# EAGLE schematic ESWschematic (EAGLE 9.2.2)
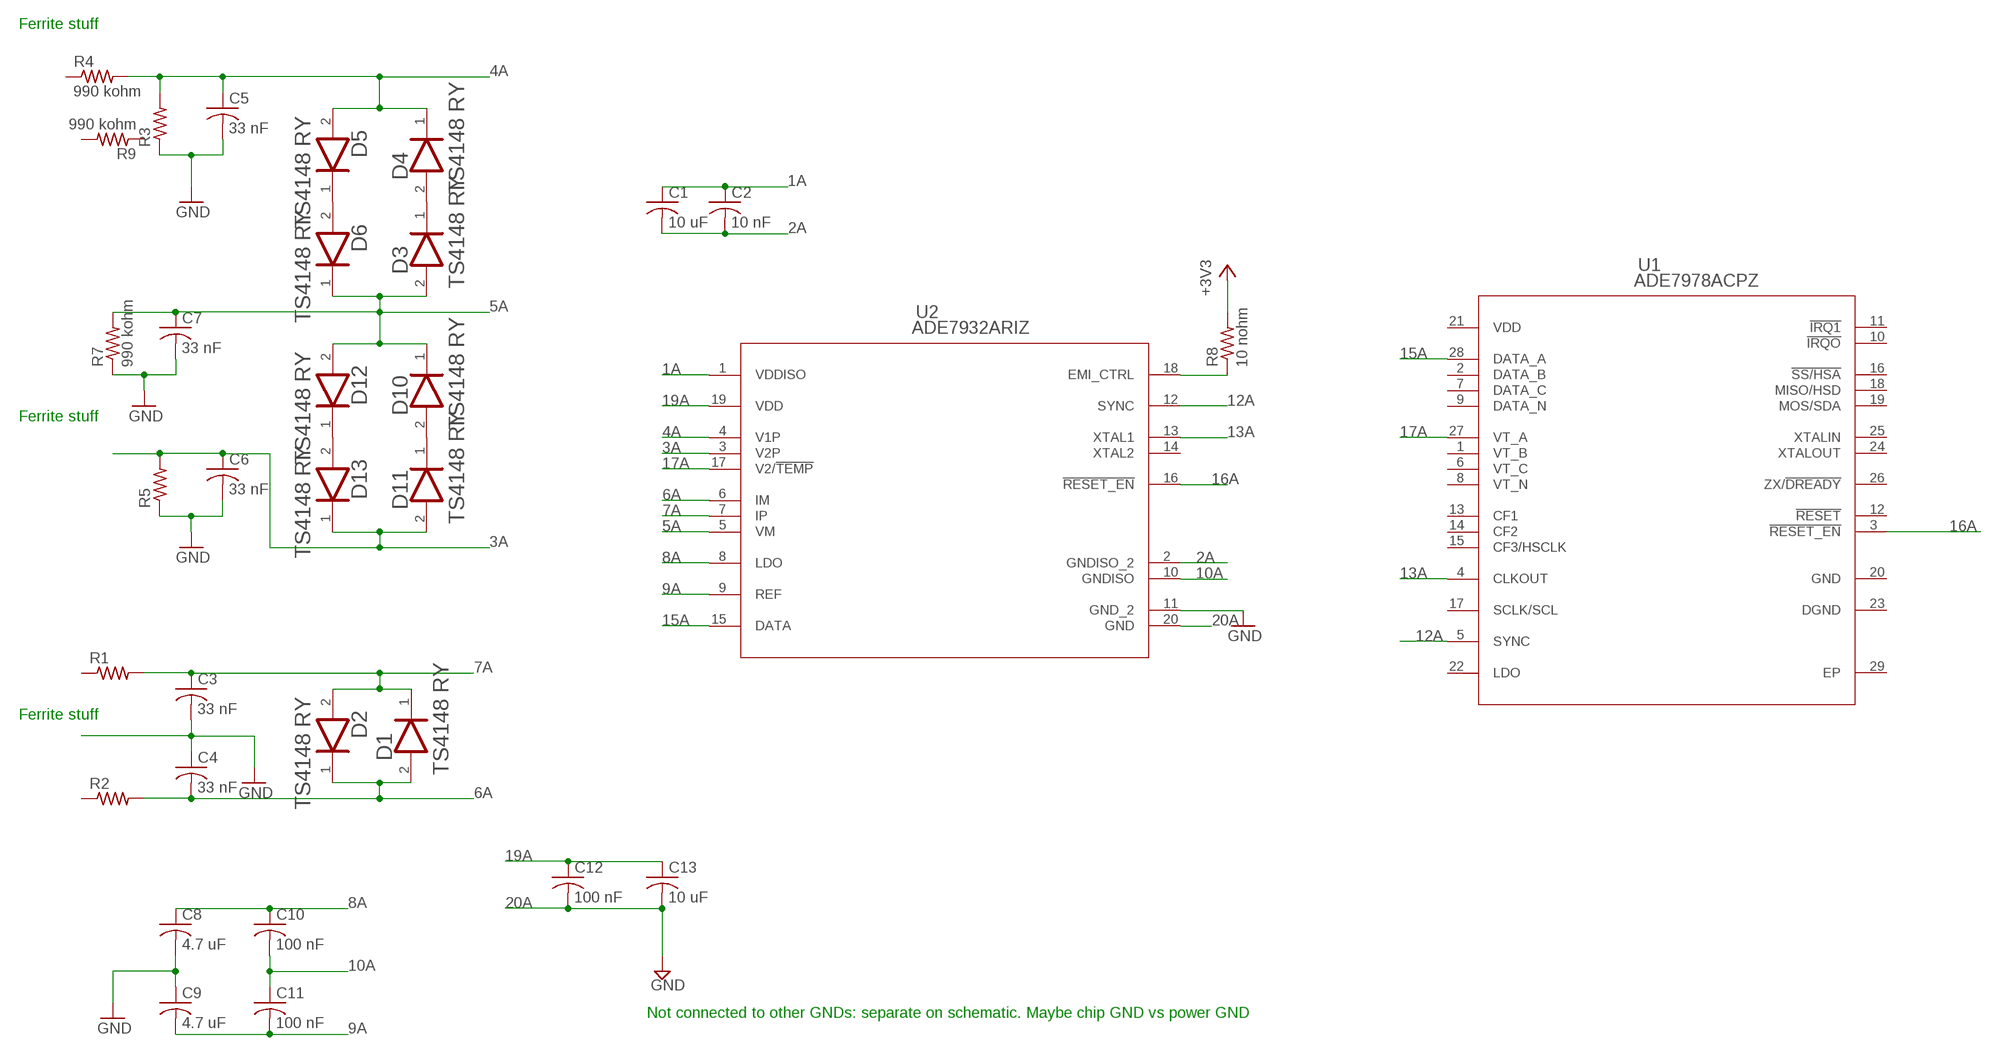
[diagram p0: schematic, sheet 1]

## Parts
C1  10 uF  C-USC0805  [C0805]
C2  10 nF  C-USC0805  [C0805]
C3  33 nF  C-USC0805  [C0805]
C4  33 nF  C-USC0805  [C0805]
C5  33 nF  C-USC0805  [C0805]
C6  33 nF  C-USC0805  [C0805]
C7  33 nF  C-USC0805  [C0805]
C8  4.7 uF  C-USC0805  [C0805]
C9  4.7 uF  C-USC0805  [C0805]
C10  100 nF  C-USC0805  [C0805]
C11  100 nF  C-USC0805  [C0805]
C12  100 nF  C-USC0805  [C0805]
C13  10 uF  C-USC0805  [C0805]
D1  TAIWAN_SEMICONDUCTOR_TS4148_RYTAIWAN_SEMICONDUCTOR_TS4148_RY_0_0  [TAIWAN_SEMICONDUCTOR_TS4148_RY_0]
D2  TAIWAN_SEMICONDUCTOR_TS4148_RYTAIWAN_SEMICONDUCTOR_TS4148_RY_0_0  [TAIWAN_SEMICONDUCTOR_TS4148_RY_0]
D3  TAIWAN_SEMICONDUCTOR_TS4148_RYTAIWAN_SEMICONDUCTOR_TS4148_RY_0_0  [TAIWAN_SEMICONDUCTOR_TS4148_RY_0]
D4  TAIWAN_SEMICONDUCTOR_TS4148_RYTAIWAN_SEMICONDUCTOR_TS4148_RY_0_0  [TAIWAN_SEMICONDUCTOR_TS4148_RY_0]
D5  TAIWAN_SEMICONDUCTOR_TS4148_RYTAIWAN_SEMICONDUCTOR_TS4148_RY_0_0  [TAIWAN_SEMICONDUCTOR_TS4148_RY_0]
D6  TAIWAN_SEMICONDUCTOR_TS4148_RYTAIWAN_SEMICONDUCTOR_TS4148_RY_0_0  [TAIWAN_SEMICONDUCTOR_TS4148_RY_0]
D10  TAIWAN_SEMICONDUCTOR_TS4148_RYTAIWAN_SEMICONDUCTOR_TS4148_RY_0_0  [TAIWAN_SEMICONDUCTOR_TS4148_RY_0]
D11  TAIWAN_SEMICONDUCTOR_TS4148_RYTAIWAN_SEMICONDUCTOR_TS4148_RY_0_0  [TAIWAN_SEMICONDUCTOR_TS4148_RY_0]
D12  TAIWAN_SEMICONDUCTOR_TS4148_RYTAIWAN_SEMICONDUCTOR_TS4148_RY_0_0  [TAIWAN_SEMICONDUCTOR_TS4148_RY_0]
D13  TAIWAN_SEMICONDUCTOR_TS4148_RYTAIWAN_SEMICONDUCTOR_TS4148_RY_0_0  [TAIWAN_SEMICONDUCTOR_TS4148_RY_0]
R1  R-US_0617/17  [0617/17]
R2  R-US_0617/17  [0617/17]
R3  R-US_0617/17  [0617/17]
R4  990 kohm  R-US_0617/17  [0617/17]
R5  R-US_0617/17  [0617/17]
R7  990 kohm  R-US_0204/7  [0204/7]
R8  10 nohm  R-US_0617/17  [0617/17]
R9  990 kohm  R-US_0411/15  [0411/15]
U1  ADE7978ACPZ  [CP_28_6]
U2  ADE7932ARIZ  [RI_20_1]

## Nets
1A: C1.1 C2.1 U2.1(VDDISO)
2A: C1.2 C2.2 U2.2(GNDISO_2)
3A: C6.1 D11.2(ANODE) D13.1(CATHODE) R5.2 U2.3(V2P)
4A: C5.1 D4.1(CATHODE) D5.2(ANODE) R3.2 R4.2 U2.4(V1P)
5A: C7.1 D3.2(ANODE) D6.1(CATHODE) D10.1(CATHODE) D12.2(ANODE) R7.2 U2.5(VM)
6A: C4.2 D1.2(ANODE) D2.1(CATHODE) R2.2 U2.6(IM)
7A: C3.1 D1.1(CATHODE) D2.2(ANODE) R1.2 U2.7(IP)
8A: C8.1 C10.1 U2.8(LDO)
9A: C9.2 C11.2 U2.9(REF)
10A: C10.2 C11.1 U2.10(GNDISO)
12A: U1.5(SYNC) U2.12(SYNC)
13A: U1.4(CLKOUT) U2.13(XTAL1)
15A: U1.28(DATA_A) U2.15(DATA)
16A: U1.3(!RESET_EN) U2.16(!RESET_EN)
17A: U1.27(VT_A) U2.17(V2/!TEMP)
19A: C12.1 C13.1 U2.19(VDD)
20A: C12.2 C13.2 U2.20(GND) ; supply symbol labelled GND
+3V3: R8.2
GND: C3.2 C4.1 C5.2 C6.2 C7.2 C8.2 C9.1 R3.1 R5.1 R7.1 U2.11(GND_2)
N$1: D3.1(CATHODE) D4.2(ANODE)
N$2: D5.1(CATHODE) D6.2(ANODE)
N$3: D12.1(CATHODE) D13.2(ANODE)
N$5: D10.2(ANODE) D11.1(CATHODE)
N$12: R8.1 U2.18(EMI_CTRL)
Unconnected: R1.1 R2.1 R4.1 R9.1 R9.2 U1.1(VT_B) U1.2(DATA_B) U1.6(VT_C) U1.7(DATA_C) U1.8(VT_N) U1.9(DATA_N) U1.10(!IRQO) U1.11(!IRQ1) U1.12(!RESET) U1.13(CF1) U1.14(CF2) U1.15(CF3/HSCLK) U1.16(!SS/HSA) U1.17(SCLK/SCL) U1.18(MISO/HSD) U1.19(MOS/SDA) U1.20(GND) U1.21(VDD) U1.22(LDO) U1.23(DGND) U1.24(XTALOUT) U1.25(XTALIN) U1.26(ZX/!DREADY) U1.29(EP) U2.14(XTAL2)

## Notes on the sheet
- Ferrite stuff
- Ferrite stuff
- Ferrite stuff
- Not connected to other GNDs: separate on schematic. Maybe chip GND vs power GND

## Library data of the parts
C1-C13 = rcl:C-US: CAPACITOR, American symbol; SPICEPREFIX: C
D1-D6 D10-D13 = Taiwan Semiconductor - TS4148 RY:TAIWAN_SEMICONDUCTOR_TS4148_RY: 150mA, 75V Switching Diode; CENTROID_NOT_SPECIFIED: No; DATASHEET: http://www.taiwansemi.com/products/datasheet/TS4148%20RYG_M1612.pdf; LEAD_FREE: yes; MF: Taiwan Semiconductor; MFG_PACKAGE_IDENT: 0805; MOUSER_PART_NUMBER: 821-TS4148-0805-RY; MPN: TS4148 RY; PACKAGE: 0805 (2012 metric); PREFIX: D; ROHS: yes; TEMPERATURE_RANGE_HIGH: +175°C; TEMPERATURE_RANGE_LOW: -55°C
R1-R5 R7-R9 = rcl:R-US_: RESISTOR, American symbol; SPICEPREFIX: R
U1 = ESWchips:ADE7978ACPZ: ADE7978 Chip
U2 = ESWchips:ADE7932ARIZ: ADE7932 Chip